# EasyEDA schematic IBus BMW DAC Test.json

## Sheets
1 HDMI Inlet: TITLE: HDMI Inlet; REV: 1.0; Date: 2023-12-09; Sheet: 1/3; Drawn By: Aidan Franits; Company: AidF Electronics
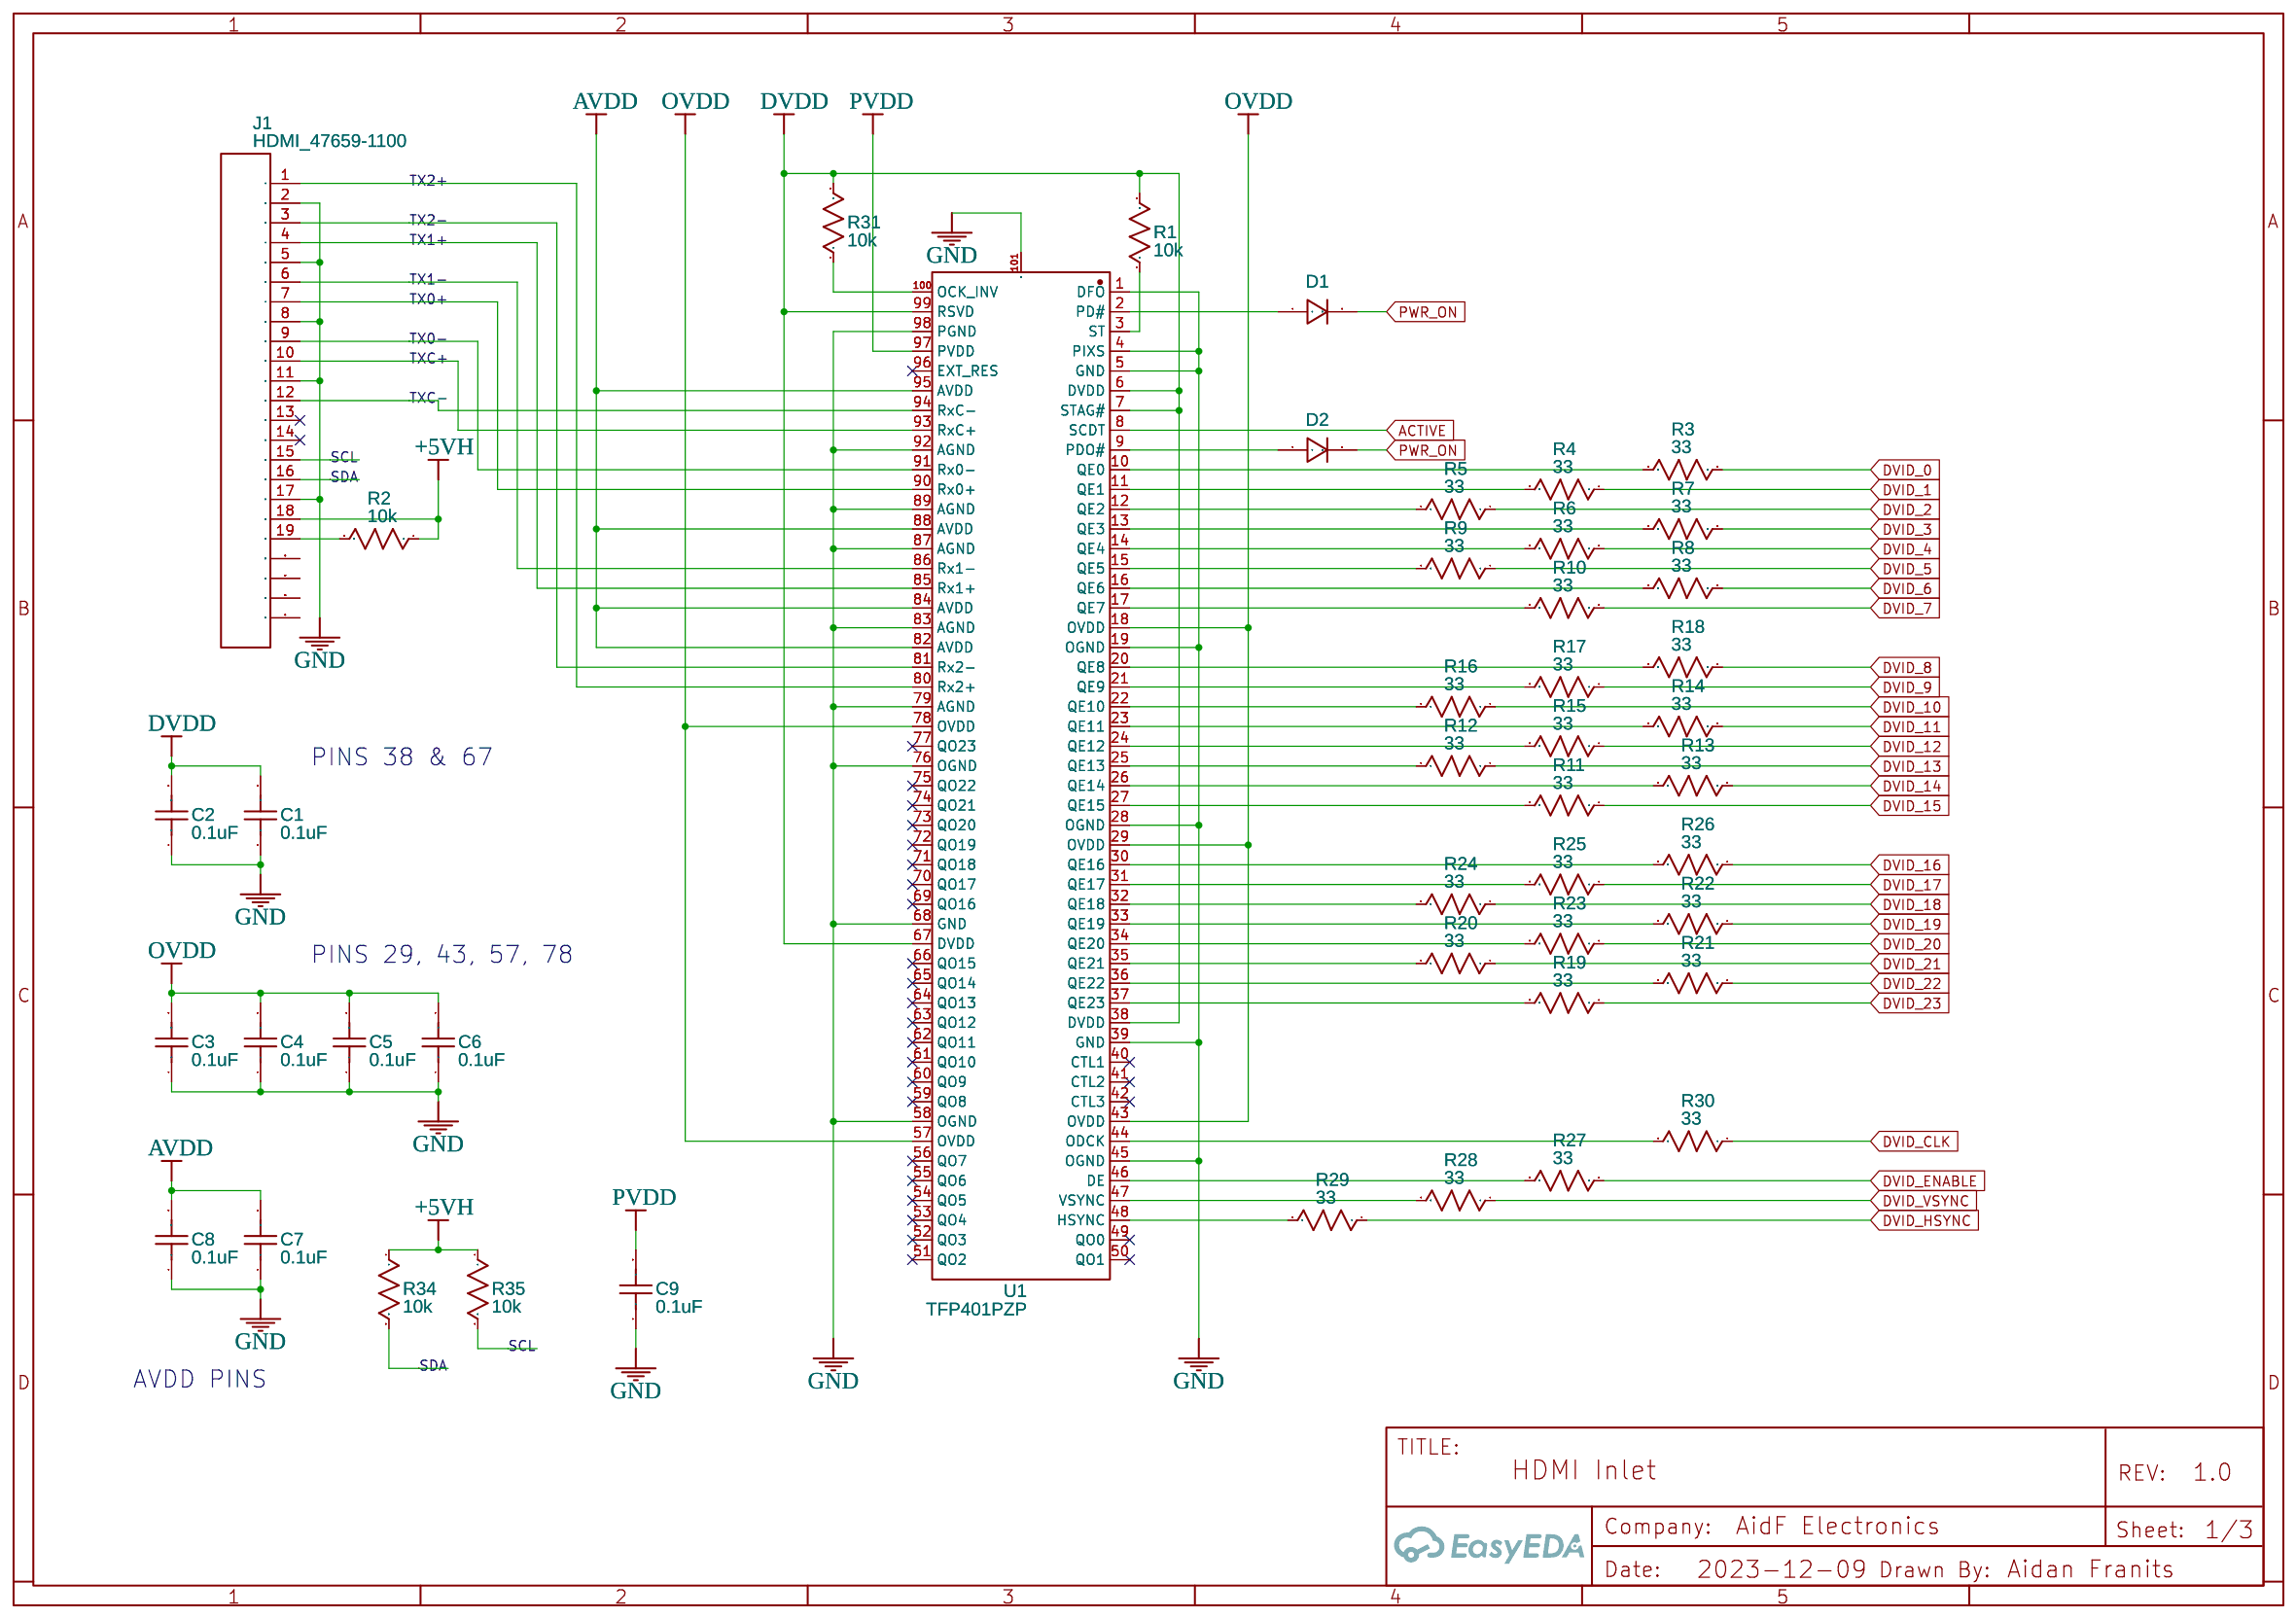
[diagram p0: HDMI Inlet]
2 Power and Power Connector: TITLE: Power and Power Connector; Date: 2023-12-15; Sheet: 2/3
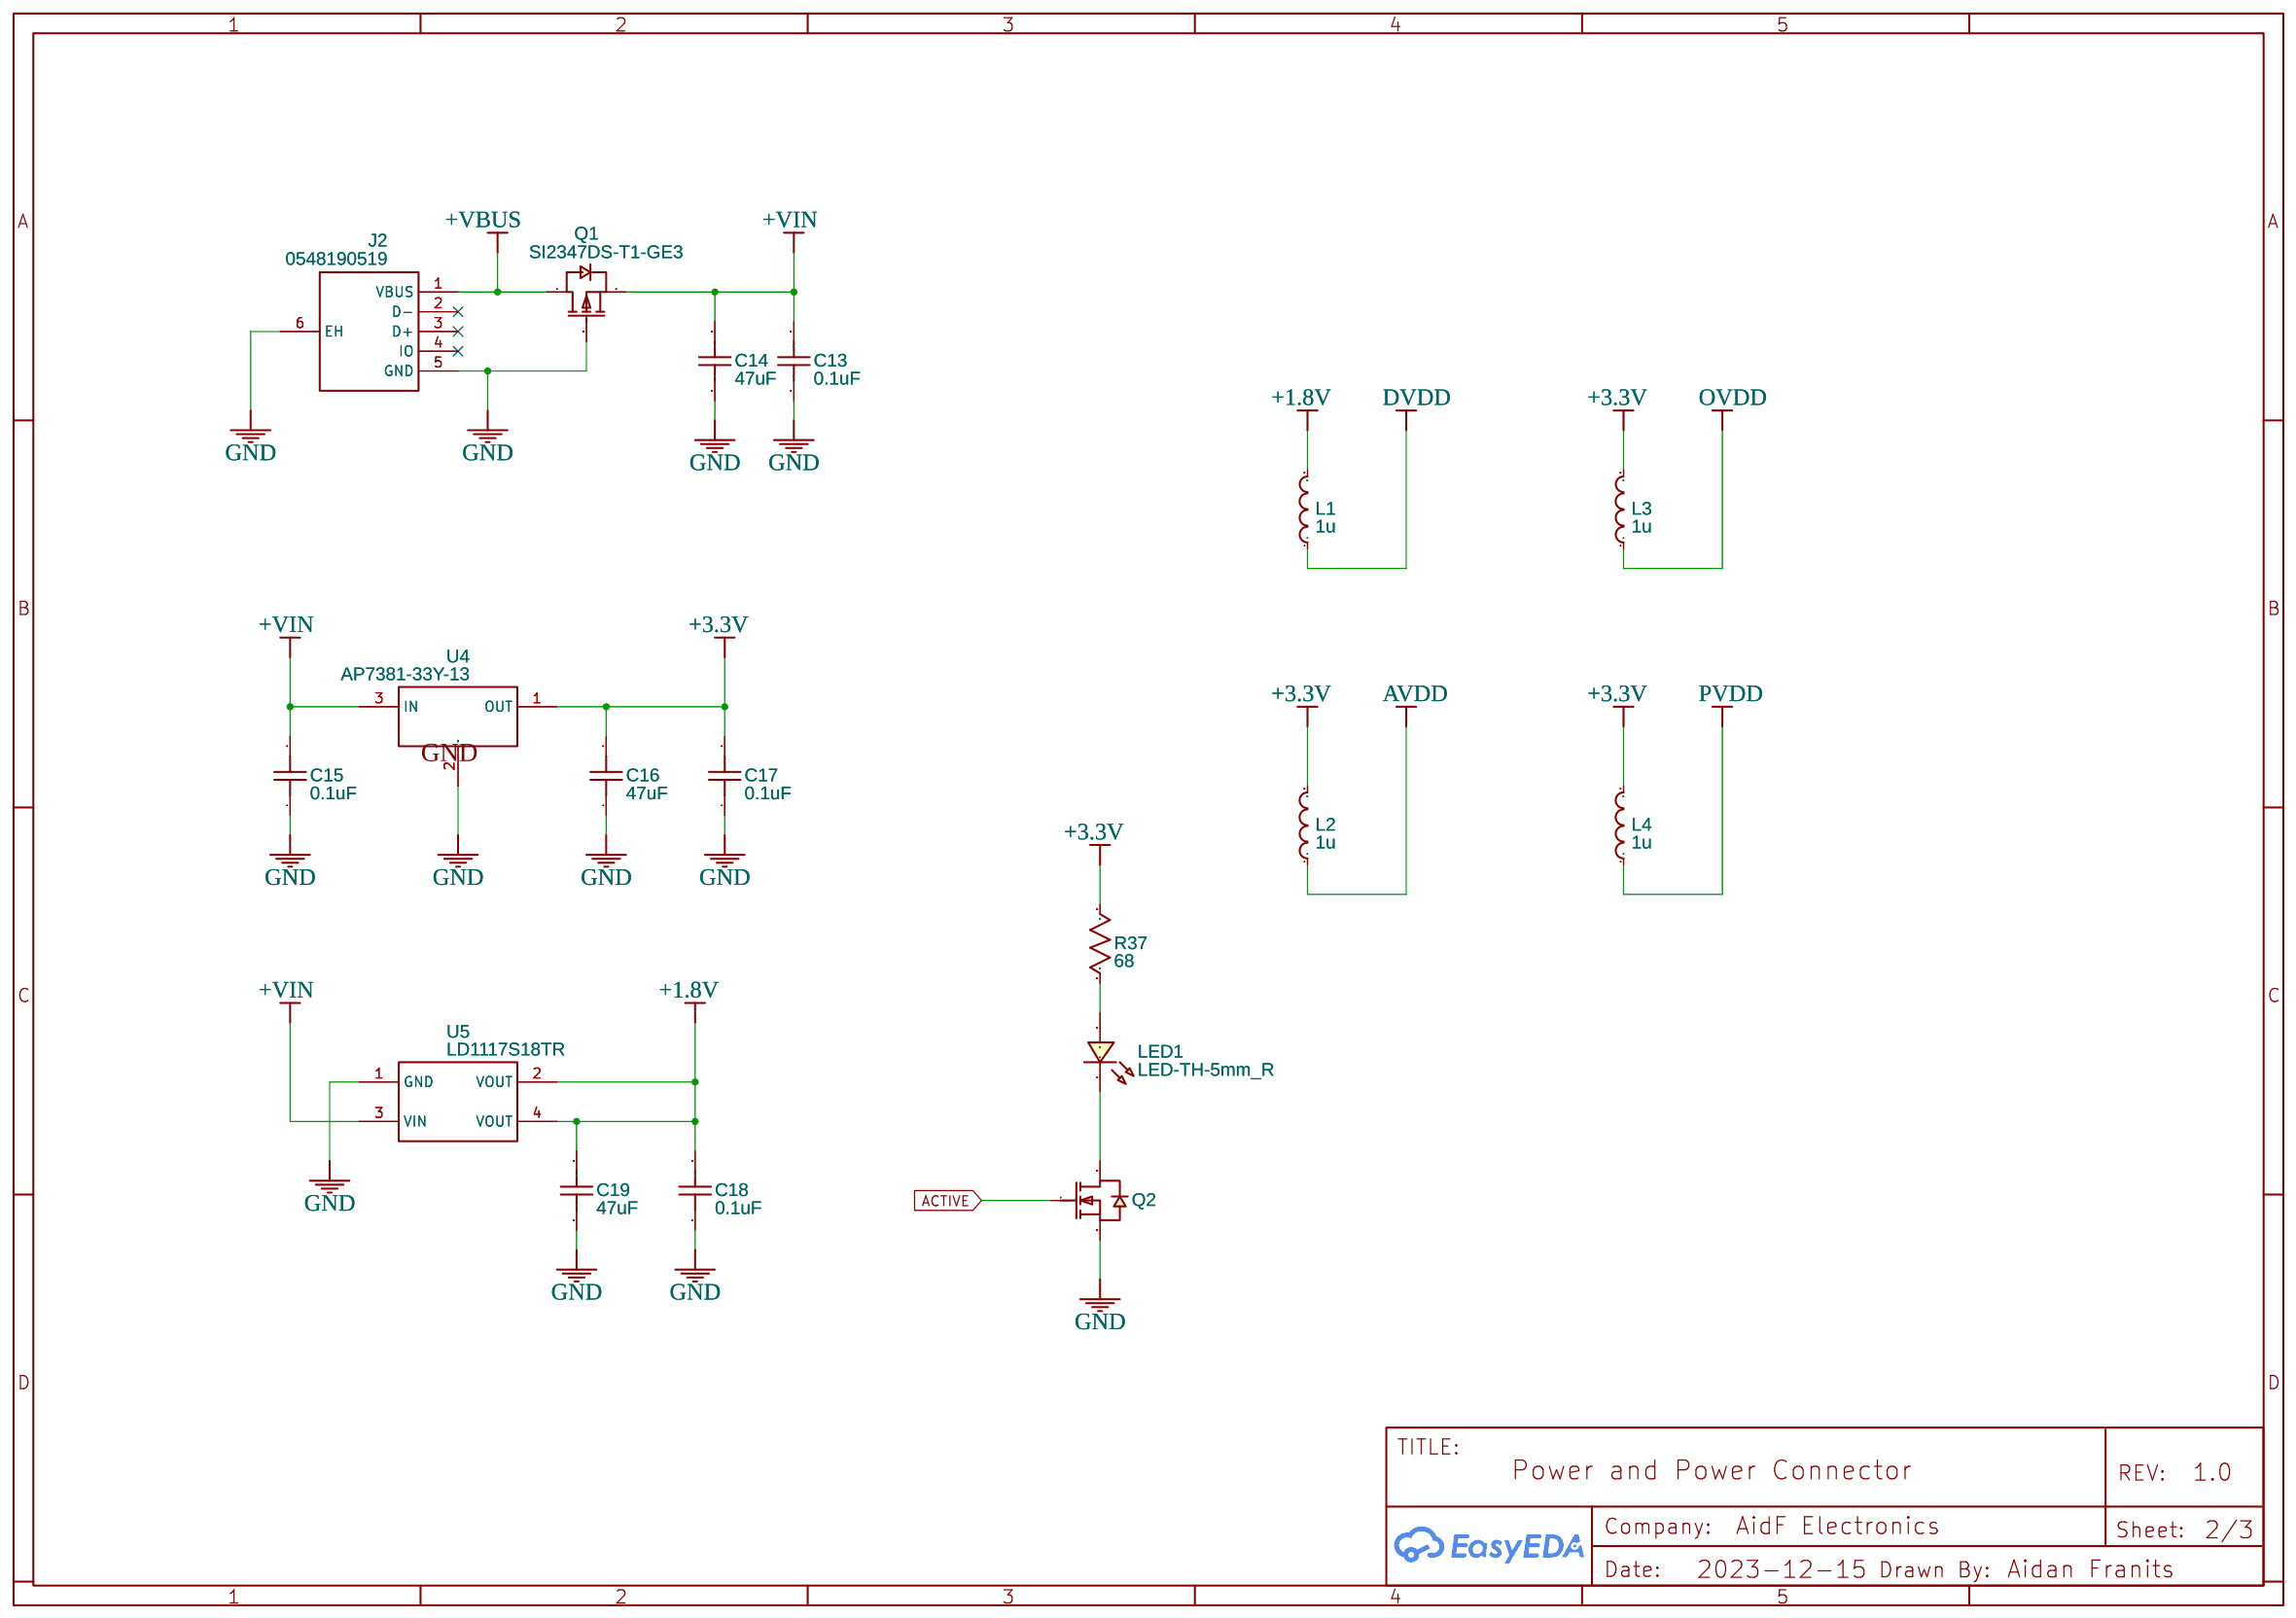
[diagram p1: Power and Power Connector]
3 RGB Output: TITLE: RGB Output; Date: 2023-12-10; Sheet: 3/3
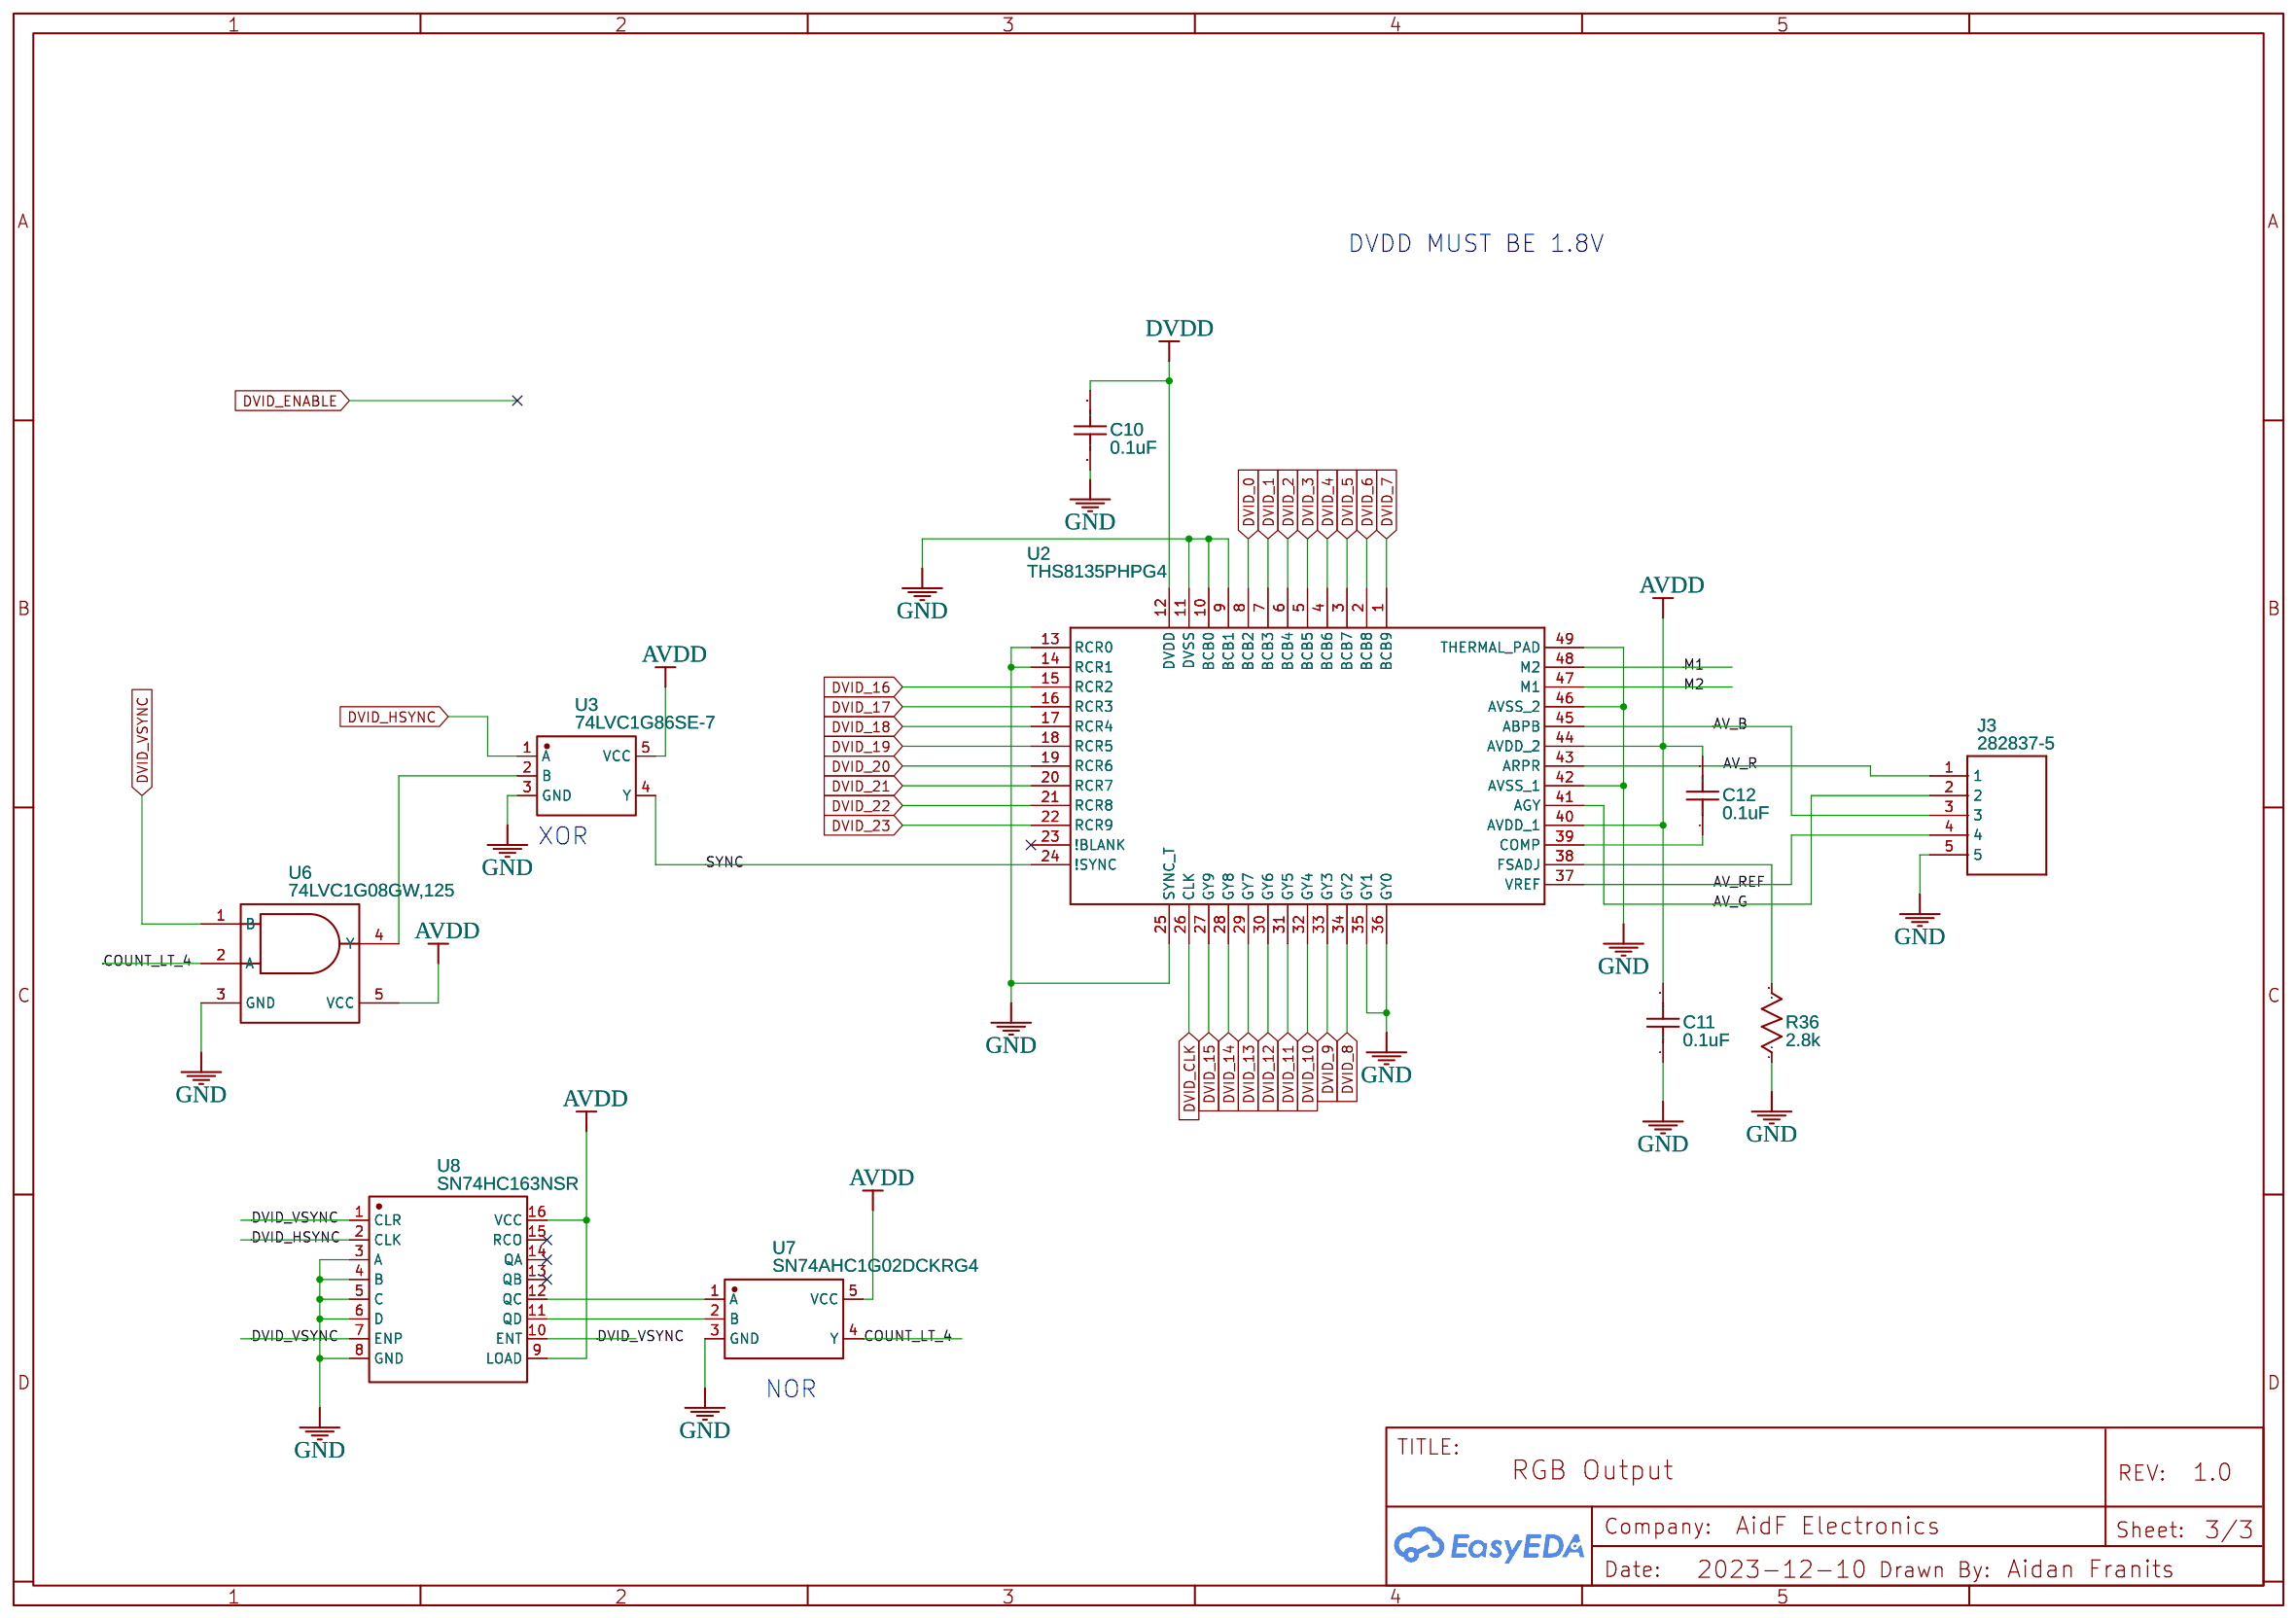
[diagram p2: RGB Output]

## Parts
sheet HDMI Inlet
C1  0.1uF  [C0603]
C2  0.1uF  [C0603]
C3  0.1uF  [C0603]
C4  0.1uF  [C0603]
C5  0.1uF  [C0603]
C6  0.1uF  [C0603]
C7  0.1uF  [C0603]
C8  0.1uF  [C0603]
C9  0.1uF  [C0603]
D1  SD103AWS-TP  [SOD-323_L1.8-W1.3-LS2.6-FD]
D2  SD103AWS-TP  [SOD-323_L1.8-W1.3-LS2.6-FD]
J1  HDMI_47659-1100  [2086581051]
R1  10k  [R0603]
R2  10k  [R0603]
R3  33  [R0603]
R4  33  [R0603]
R5  33  [R0603]
R6  33  [R0603]
R7  33  [R0603]
R8  33  [R0603]
R9  33  [R0603]
R10  33  [R0603]
R11  33  [R0603]
R12  33  [R0603]
R13  33  [R0603]
R14  33  [R0603]
R15  33  [R0603]
R16  33  [R0603]
R17  33  [R0603]
R18  33  [R0603]
R19  33  [R0603]
R20  33  [R0603]
R21  33  [R0603]
R22  33  [R0603]
R23  33  [R0603]
R24  33  [R0603]
R25  33  [R0603]
R26  33  [R0603]
R27  33  [R0603]
R28  33  [R0603]
R29  33  [R0603]
R30  33  [R0603]
R31  10k  [R0603]
R34  10k  [R0603]
R35  10k  [R0603]
U1  TFP401PZP  [HTQFP-100_L14.0-W14.0-P0.50-LS16.0-BL-EP5.2]
sheet Power and Power Connector
C13  0.1uF  [C0603]
C14  47uF  [C1206]
C15  0.1uF  [C0603]
C16  47uF  [C1206]
C17  0.1uF  [C0603]
C18  0.1uF  [C0603]
C19  47uF  [C1206]
J2  0548190519  [MICRO-USB-TH_0548190519]
L1  1u  [L0603]
L2  1u  [L0603]
L3  1u  [L0603]
L4  1u  [L0603]
LED1  LED-TH-5mm_R  [LED-TH_BD5.0_RED]
Q1  SI2347DS-T1-GE3  [SOT-23-3_L2.9-W1.3-P1.83-LS2.4-BR-1]
Q2  DMN67D8LW-13  [SOT-323-3_L2.2-W1.3-P1.30-LS2.1-BR]
R37  68  [R0603]
U4  AP7381-33Y-13  [SOT-89-3_L4.5-W2.5-P1.50-LS4.2-BR]
U5  LD1117S18TR  [SOT-223_L6.5-W3.5-P2.30-LS7.0-BR]
sheet RGB Output
C10  0.1uF  [C0603]
C11  0.1uF  [C0603]
C12  0.1uF  [C0603]
J3  282837-5  [TE_282837-5]
R36  2.8k  [R0603]
U2  THS8135PHPG4  [QFP50P900X900X120-49N]
U3  74LVC1G86SE-7  [SOT-353-5_L2.0-W1.3-P0.65-LS2.1-BR]
U6  74LVC1G08GW,125  [SOT-353_L2.1-W1.3-P0.65-LS2.3-BR]
U7  SN74AHC1G02DCKRG4  [SC-70-5_L2.1-W1.3-P0.65-LS2.1-BR]
U8  SN74HC163NSR  [SO-16_L10.3-W5.3-P1.27-LS7.8-BL]

## Library data of the parts
C1-C12 = C_0603_US: Supplier Part: 1292-1392-1-ND; Supplier: Digi-Key; Contributor: LCEDA_Lib; Manufacturer Part: 0603B104K101CT; Manufacturer: Walsin Technology Corporation
D1 D2 = 1N4148: Supplier: Digi-Key; Supplier Part: SD103AWSTPMSCT-ND; Manufacturer: Micro Commercial Co; Contributor: LCSC
J1 = HDMI_47659-1100: Contributor: afftspiau; Supplier: Digi-Key; Supplier Part: 900-2086581051CT-ND; Manufacturer: Molex; link: https://www.molex.com/pdm_docs/sd/476591100_sd.pdf
R1 R2 R31 R34 R35 = R_0603_US: Supplier Part: RHM10KDCT-ND; Supplier: Digi-Key; Contributor: LCEDA_Lib; Manufacturer Part: ESR03EZPJ103; Manufacturer: Rohm Semiconductor
R3-R30 = R_0603_US: Supplier Part: 1292-WR06X330JTLCT-ND; Supplier: Digi-Key; Contributor: LCEDA_Lib; Manufacturer Part: WR06X330 JTL; Manufacturer: Walsin Technology Corporation
U1 = TFP401PZP: Contributor: LCSC; Supplier: Digi-Key; Supplier Part: 296-9992-ND; Manufacturer: Texas Instruments; JLCPCB Part Class: Extended Part; link: https://lcsc.com/eda_search?q=C2867606&%26type=1&ref=editor
C13 C15 C17 C18 = C_0603_US: Supplier Part: 1292-1392-2-ND; Supplier: Digi-Key; Contributor: LCEDA_Lib; Manufacturer Part: 0603B104K101CT; Manufacturer: Walsin Technology Corporation
C14 C16 C19 = C_0603_US: Supplier Part: 490-GRM31CR61E476ME44KCT-ND; Supplier: Digi-Key; Contributor: LCEDA_Lib; Manufacturer Part: GRM31CR61E476ME44K; Manufacturer: Murata Electronics
J2 = 0548190519: Contributor: LCSC; Supplier: Digi-Key; Supplier Part: WM17115-ND; Manufacturer: Molex
L1-L4 = L0603_US: Supplier Part: 490-5227-1-ND; Supplier: Digi-Key; Contributor: LCEDA_Lib; Manufacturer Part: BLM18RK601SN1D; Manufacturer: Murata Electronics
LED1 = LED-TH-5mm_R: Supplier Part: 1080-1597-1-ND; Supplier: Digi-Key; Contributor: LCEDA_Lib
Q1 = IRF5210: Supplier: Digi-Key; Manufacturer: Vishay Siliconix; Supplier Part: SI2347DS-T1-GE3CT-ND; Contributor: LCEDA_Lib
Q2 = 2N7002: Supplier: Digi-Key; Manufacturer: Diodes Incorporated; Supplier Part: DMN67D8LW-13DICT-ND; Contributor: LCEDA_Lib
R37 = R_0603_US: Supplier Part: 1292-WR06X680JTLCT-ND; Supplier: Digi-Key; Contributor: LCEDA_Lib; Manufacturer Part: WR06X680 JTL; Manufacturer: Walsin Technology Corporation
U4 = AP7381-33Y-13: Contributor: LCSC; Supplier: Digi-Key; Supplier Part: AP7370-33Y-13DICT-ND; Manufacturer: Diodes Incorporated; Manufacturer Part: AP7370-33Y-13; JLCPCB Part Class: Extended Part
U5 = LD1117S18TR: Contributor: LCSC; Supplier: Digi-Key; Supplier Part: 497-7308-1-ND; Manufacturer: STMicroelectronics; JLCPCB Part Class: Extended Part
J3 = 282837-5: Contributor: wessel nomen; Supplier: Digi-Key; Supplier Part: 282837-5-ND; Manufacturer: TE Connectivity AMP Connectors
R36 = R_0603_US: Supplier Part: RMCF0603FT2K80CT-ND; Supplier: Digi-Key; Contributor: LCEDA_Lib; Manufacturer Part: RMCF0603FT2K80; Manufacturer: Stackpole Electronics Inc
U2 = THS8135PHPG4: Contributor: Marlon Vinicius; Manufacturer Part: THS8135PHP; Supplier: Digi-Key; Supplier Part: 296-13049-5-ND; Manufacturer: Texas Instruments
U3 = 74LVC1G86SE-7: Contributor: LCSC; Supplier: Digi-Key; Supplier Part: 74LVC1G86SE-7DICT-ND; Manufacturer: Diodes Incorporated; JLCPCB Part Class: Extended Part
U6 = 74LVC1G08GW,125: Supplier: Digi-Key; Manufacturer: Nexperia USA Inc.; Supplier Part: 1727-2872-1-ND; JLCPCB Part Class: Extended Part
U7 = SN74AHC1G02DCKRG4: Contributor: LCSC; Supplier: LCSC; Supplier Part: C2865650; Manufacturer: TI(德州仪器)
U8 = SN74HC163NSR: Contributor: LCSC; Supplier: Digi-Key; Supplier Part: 296-12889-1-ND; Manufacturer: Texas Instruments

## Nets
+1.8V: C18.2 C19.2 L1.2 U5.2(VOUT) U5.4(VOUT)
+3.3V: C16.2 C17.2 L2.2 L3.2 L4.2 R37.1 U4.1(OUT)
+5VH: J1.18 R2.1 R34.1 R35.1
+VBUS: J2.1(VBUS) Q1.3(D)
+VIN: C13.2 C14.2 C15.2 Q1.2(S) U4.3(IN) U5.3(VIN)
AVDD: C7.2 C8.2 C11.2 C12.2 L2.1 U1.82(AVDD) U1.84(AVDD) U1.88(AVDD) U1.95(AVDD) U2.40(AVDD_1) U2.44(AVDD_2) U3.5(VCC) U6.5(VCC) U7.5(VCC) U8.9(LOAD) U8.16(VCC)
DVDD: C1.2 C2.2 C10.2 L1.1 R1.2 R31.2 U1.6(DVDD) U1.7(STAG#) U1.38(DVDD) U1.67(DVDD) U1.99(RSVD) U2.12(DVDD)
GND: C1.1 C2.1 C3.1 C4.1 C5.1 C6.1 C7.1 C8.1 C9.1 C10.1 C11.1 C13.1 C14.1 C15.1 C16.1 C17.1 C18.1 C19.1 J1.2 J1.5 J1.8 J1.11 J1.17 J2.5(GND) J2.6(EH) J3.5 Q1.1(G) Q2.2(S) R36.1 U1.1(DFO) U1.4(PIXS) U1.5(GND) U1.19(OGND) U1.28(OGND) U1.39(GND) U1.45(OGND) U1.58(OGND) U1.68(GND) U1.76(OGND) U1.79(AGND) U1.83(AGND) U1.87(AGND) U1.89(AGND) U1.92(AGND) U1.98(PGND) U1.101(PAD) U2.9(BCB1) U2.10(BCB0) U2.11(DVSS) U2.13(RCR0) U2.14(RCR1) U2.25(SYNC_T) U2.35(GY1) U2.36(GY0) U2.42(AVSS_1) U2.46(AVSS_2) U2.49(THERMAL_PAD) U3.3(GND) U4.2(GND) U5.1(GND) U6.3(GND) U7.3(GND) U8.3(A) U8.4(B) U8.5(C) U8.6(D) U8.8(GND)
PVDD: C9.2 L4.1 U1.97(PVDD)
ACTIVE: Q2.1(G) U1.8(SCDT)
AV_B: J3.3 U2.45(ABPB)
AV_G: J3.2 U2.41(AGY)
AV_R: J3.1 U2.43(ARPR)
AV_REF: J3.4 U2.37(VREF)
COUNT_LT_4: U6.2(A) U7.4(Y)
DVID_0: R3.1 U2.8(BCB2)
DVID_1: R4.1 U2.7(BCB3)
DVID_2: R5.1 U2.6(BCB4)
DVID_3: R7.1 U2.5(BCB5)
DVID_4: R6.1 U2.4(BCB6)
DVID_5: R9.1 U2.3(BCB7)
DVID_6: R8.1 U2.2(BCB8)
DVID_7: R10.1 U2.1(BCB9)
DVID_8: R18.1 U2.34(GY2)
DVID_9: R17.1 U2.33(GY3)
DVID_10: R16.1 U2.32(GY4)
DVID_11: R14.1 U2.31(GY5)
DVID_12: R15.1 U2.30(GY6)
DVID_13: R12.1 U2.29(GY7)
DVID_14: R13.1 U2.28(GY8)
DVID_15: R11.1 U2.27(GY9)
DVID_16: R26.1 U2.15(RCR2)
DVID_17: R25.1 U2.16(RCR3)
DVID_18: R24.1 U2.17(RCR4)
DVID_19: R22.1 U2.18(RCR5)
DVID_20: R23.1 U2.19(RCR6)
DVID_21: R20.1 U2.20(RCR7)
DVID_22: R21.1 U2.21(RCR8)
DVID_23: R19.1 U2.22(RCR9)
DVID_CLK: R30.1 U2.26(CLK)
DVID_ENABLE: R27.1
DVID_HSYNC: R29.1 U3.1(A) U8.2(CLK)
DVID_VSYNC: R28.1 U6.1(B) U8.1(CLR) U8.7(ENP) U8.10(ENT)
M1: U2.48(M2)
M2: U2.47(M1)
OVDD: C3.2 C4.2 C5.2 C6.2 L3.1 U1.18(OVDD) U1.29(OVDD) U1.43(OVDD) U1.57(OVDD) U1.78(OVDD)
PWR_ON: D1.2 D2.2
SCL: J1.15 R35.2
SDA: J1.16 R34.2
SYNC: U2.24(!SYNC) U3.4(Y)
TX0+: J1.7 U1.90(Rx0+)
TX0-: J1.9 U1.91(Rx0-)
TX1+: J1.4 U1.85(Rx1+)
TX1-: J1.6 U1.86(Rx1-)
TX2+: J1.1 U1.80(Rx2+)
TX2-: J1.3 U1.81(Rx2-)
TXC+: J1.10 U1.93(RxC+)
TXC-: J1.12 U1.94(RxC-)
Net-(C12-1): C12.1 U2.39(COMP)
Net-(D1-1): D1.1 U1.2(PD#)
Net-(D2-1): D2.1 U1.9(PDO#)
Net-(J1-19): J1.19 R2.2
Net-(LED1-1): LED1.1 R37.2
Net-(LED1-2): LED1.2 Q2.3(D)
Net-(R1-1): R1.1 U1.3(ST)
Net-(R3-2): R3.2 U1.10(QE0)
Net-(R4-2): R4.2 U1.11(QE1)
Net-(R5-2): R5.2 U1.12(QE2)
Net-(R6-2): R6.2 U1.14(QE4)
Net-(R7-2): R7.2 U1.13(QE3)
Net-(R8-2): R8.2 U1.16(QE6)
Net-(R9-2): R9.2 U1.15(QE5)
Net-(R10-2): R10.2 U1.17(QE7)
Net-(R11-2): R11.2 U1.27(QE15)
Net-(R12-2): R12.2 U1.25(QE13)
Net-(R13-2): R13.2 U1.26(QE14)
Net-(R14-2): R14.2 U1.23(QE11)
Net-(R15-2): R15.2 U1.24(QE12)
Net-(R16-2): R16.2 U1.22(QE10)
Net-(R17-2): R17.2 U1.21(QE9)
Net-(R18-2): R18.2 U1.20(QE8)
Net-(R19-2): R19.2 U1.37(QE23)
Net-(R20-2): R20.2 U1.35(QE21)
Net-(R21-2): R21.2 U1.36(QE22)
Net-(R22-2): R22.2 U1.33(QE19)
Net-(R23-2): R23.2 U1.34(QE20)
Net-(R24-2): R24.2 U1.32(QE18)
Net-(R25-2): R25.2 U1.31(QE17)
Net-(R26-2): R26.2 U1.30(QE16)
Net-(R27-2): R27.2 U1.46(DE)
Net-(R28-2): R28.2 U1.47(VSYNC)
Net-(R29-2): R29.2 U1.48(HSYNC)
Net-(R30-2): R30.2 U1.44(ODCK)
Net-(R31-1): R31.1 U1.100(OCK_INV)
Net-(R36-2): R36.2 U2.38(FSADJ)
Net-(U3-2): U3.2(B) U6.4(Y)
Net-(U7-1): U7.1(A) U8.12(QC)
Net-(U7-2): U7.2(B) U8.11(QD)

Not connected (* = marked no-connect by the designer): J1 13* 14* MH1 MH2 MH3 MH4; J2 2(D-)* 3(D+)* 4(IO)*; U1 40(CTL1)* 41(CTL2)* 42(CTL3)* 49(QO0)* 50(QO1)* 51(QO2)* 52(QO3)* 53(QO4)* 54(QO5)* 55(QO6)* 56(QO7)* 59(QO8)* 60(QO9)* 61(QO10)* 62(QO11)* 63(QO12)* 64(QO13)* 65(QO14)* 66(QO15)* 69(QO16)* 70(QO17)* 71(QO18)* 72(QO19)* 73(QO20)* 74(QO21)* 75(QO22)* 77(QO23)* 96(EXT_RES)*; U2 23(!BLANK)*; U8 13(QB)* 14(QA)* 15(RCO)*

## Notes on the sheets
sheet 1
- PINS 38 & 67
- PINS 29, 43, 57, 78
- AVDD PINS
sheet 3
- DVDD MUST BE 1.8V
- XOR
- NOR
